# EAGLE design MC34063-STEPDOWN-01 (EAGLE 5.06)
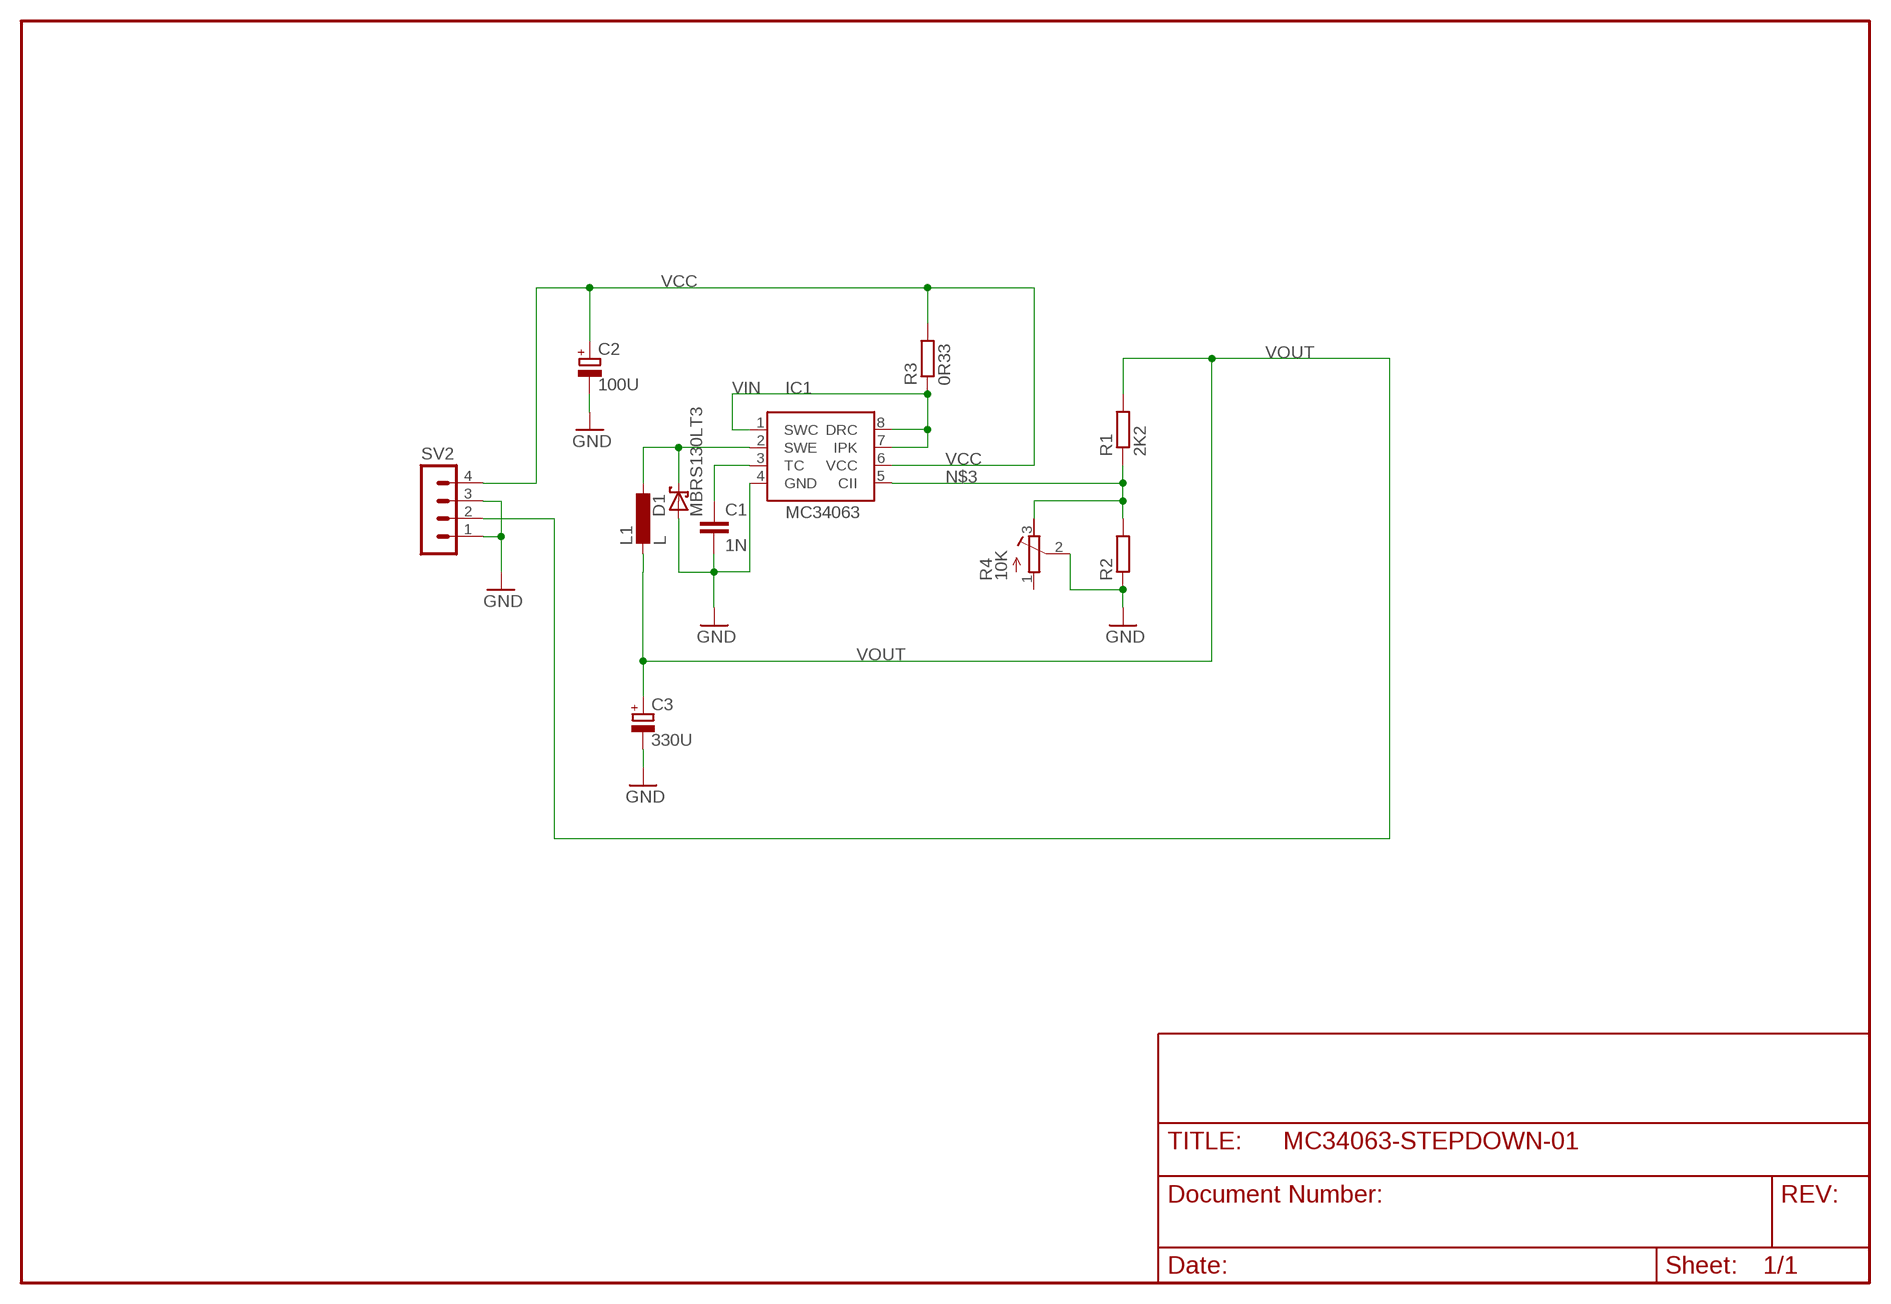
[diagram p0: schematic, sheet 1]

## Parts
C1  1N  C-EUC0805  [C0805]
C2  100U  CPOL-EUCT7343  [CT7343]
C3  330U  CPOL-EUCT7343  [CT7343]
D1  MBRS130LT3  [SMB]
IC1  MC34063  [SO08]
L1  L  [POWERINDUCTOR1]
R1  2K2  R-EU_0204/2V  [0204V]
R2  R-EU_0204/2V  [0204V]
R3  0R33  R-EU_R2010  [R2010]
R4  10K  R-TRIMM64Y  [RTRIM64Y]
SV2  MA04-1  [MA04-1]

## Nets
GND: C1.2 C2.- C3.- D1.A IC1.4(GND) R2.1 R4.2(S) SV2.1 SV2.3
N$3: IC1.5(CII) R1.1 R2.2 R4.3(A)
N$4: D1.C IC1.2(SWE) L1.P$1
N$6: C1.1 IC1.3(TC)
VCC: C2.+ IC1.6(VCC) R3.2 SV2.4
VIN: IC1.1(SWC) IC1.7(IPK) IC1.8(DRC) R3.1
VOUT: C3.+ L1.P$2 R1.2 SV2.2
Unconnected: R4.1(E)

## Library data of the parts
C1 = turbod3:C-EU: CAPACITOR, European symbol
C2 C3 = turbod3:CPOL-EU: POLARIZED CAPACITOR, European symbol
D1 = turbod3:MBRS130LT3: Schottky Power Rectifier Source: http://www.onsemi.com/pub/Collateral/MBRS130LT3-D.PDF
IC1 = turbod3:MC34063
L1 = turbod3:L
R1-R3 = turbod3:R-EU_: RESISTOR, European symbol
R4 = rcl:R-TRIMM: Trimm resistor
SV2 = con-lstb:MA04-1: PIN HEADER

## Board
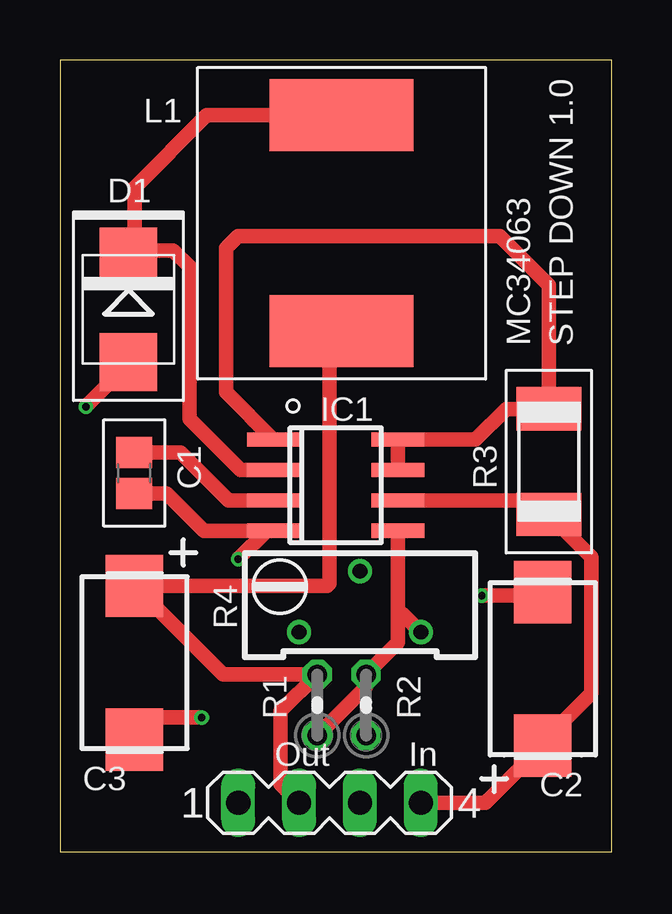
[diagram p1: board, top side]
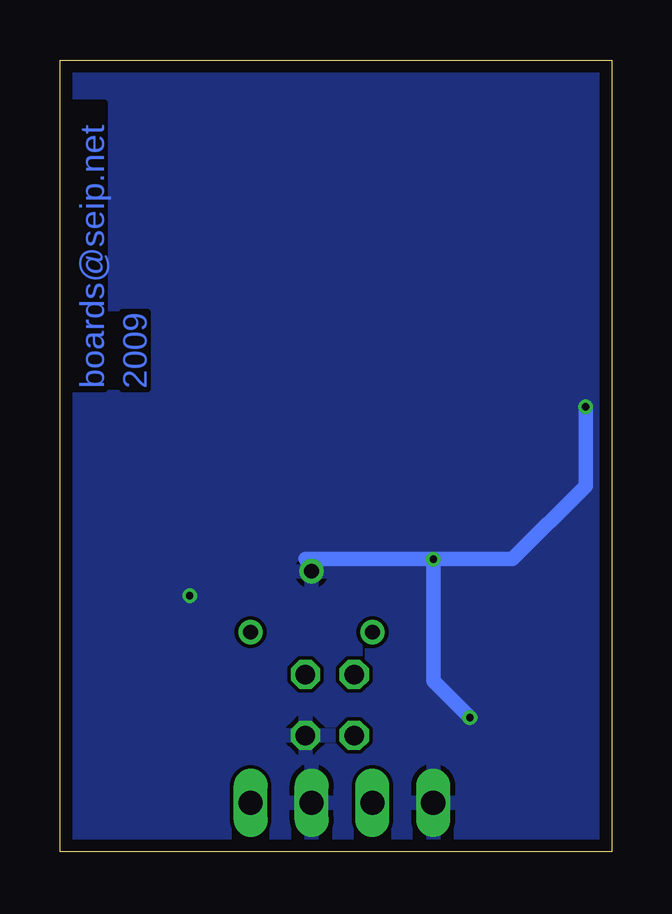
[diagram p2: board, bottom side, seen from below]

Size 23 x 33 mm. Coordinates in mm from the lower left corner, seen from the top.
Outline: 0,0 23,0 23,33 0,33 0,0
Copper layers (1*16): Top 0.035mm / dielectric 1.5mm / Bottom 0.035mm
Design rules "PCB-POOL": minimum track width 6mil, minimum drill 12mil, track to track 6mil, track to pad 6mil, pad to pad 6mil, via to via 6mil, smd to smd 6mil, copper to edge 20mil, drill to drill 8mil, minimum pad ring 8mil, minimum via ring 6mil, stop-mask expansion 3mil, vias tented up to drill 0mil, thermal gap 8mil

### Footprints (pad centres in the part's own frame; a part is rotated, then mirrored left to right if it is on the bottom)
C0805 = smd 1.3 x 1.5: 1 -0.85,0; 2 0.85,0
CT7343 = smd 2.6 x 2.4: + 3.2,0; - -3.2,0
SMB = smd 2.4 x 2.4: A 2.2,0; C -2.2,0
SO08 = smd 0.6 x 2.2: 1 -1.905,-2.6; 2 -0.635,-2.6; 3 0.635,-2.6; 4 1.905,-2.6; 5 1.905,2.6; 6 0.635,2.6; 7 -0.635,2.6; 8 -1.905,2.6
POWERINDUCTOR1 = smd 3 x 6: P$1 -4.5,0; P$2 4.5,0
0204V = drill 0.813 octagon: 1 -1.27,0; 2 1.27,0
R2010 = smd 1.8 x 2.7: 1 -2.2,0; 2 2.2,0
RTRIM64Y = drill 0.61 round: 1 0,-2.54; 2 -2.54,0; 3 0,2.54
MA04-1 = drill 1.016 long: 1 -3.81,0; 2 -1.27,0; 3 1.27,0; 4 3.81,0

### Placement (x,y rotation side)
C1  3.1,15.78 270 top
C2  20.13,7.62 270 top
C3  3.11,7.87 90 top
D1  2.86,22.61 270 top
IC1  11.49,15.27 270 top
L1  11.75,26.19 270 top
R1  10.73,6.11 90 top
R2  12.76,6.11 90 top
R3  20.38,16.26 270 top
R4  12.51,9.14 270 top
SV2  11.24,2.03 0 top

### Tracks (layer width: path | path; a pad name or v marks a point on that pad's centre or on a via)
GND  (via drill 0.3)
  Top 0.61: 2.99,20.19 3.1,20.3 | 3.04,14.99 C1.2 4.44,14.93 6.01,13.36 8.58,13.36 IC1.4 8.61,13.37 v7.43,12.19 | 20.13,10.67 C2.- 20.13,10.67 | v17.59,10.67 18.35,10.67 19.11,10.67 | 19.11,10.67 18.61,10.67 19.11,10.67 | 19.11,10.67 20.13,10.67 | 20.13,10.67 20.38,10.67 | v5.91,5.59 4.03,5.59 C3.- | D1.A 2.86,20.32 2.99,20.19 | R2.1 12.78,4.84 | 2.99,20.19 2.73,20.19 v1.08,18.54
  Bottom 0.406: R4.2 12.51,11.94 12.76,12.19
  Bottom 0.61: v7.43,12.19 12.76,12.19 | v7.43,12.19 7.43,7.11 v5.91,5.59 | v1.08,18.54 1.08,15.24 4.13,12.19 v7.43,12.19
  pour Bottom: 0.06,33.02 0.06,0 22.92,0 22.92,33.02
N$3
  Top 0.61: 14.09,9.92 IC1.5 | 14.09,9.92 14.28,9.92 R4.3 | 14.09,9.92 14.09,8.71 R2.2 12.76,6.87 R1.1
N$4
  Top 0.61: L1.P$1 6.12,30.69 3.11,27.69 3.11,25.08 3.11,25.06 | IC1.2 7.53,15.9 5.4,18.03 5.4,24.38 4.72,25.06 3.11,25.06 | 3.11,25.06 D1.C 3.11,25.06
N$6
  Top 0.61: C1.1 5.02,16.63 7.02,14.63 IC1.3
VCC
  Top 0.61: IC1.6 19.8,14.64 R3.2 22.16,12.28 22.16,6.6 20.13,4.57 C2.+ 17.74,2.03 SV2.4
VIN
  Top 0.61: IC1.7 IC1.8 17.33,17.18 18.61,18.46 R3.1 20.38,23.62 18.35,25.65 7.43,25.65 6.92,25.15 6.92,19.15 IC1.1
VOUT
  Top 0.61: L1.P$2 11.24,21.19 11.24,11.18 11.14,11.07 C3.+ 6.24,7.95 | SV2.2 9.21,2.79 9.21,5.08 9.21,5.86 R1.2 6.8,7.38 6.24,7.95 | 6.24,7.95 6.4,7.79

### Text on the board
Bottom: 2009 | boards@seip.net
tNames: MC34063 | STEP DOWN 1.0 | Out | In